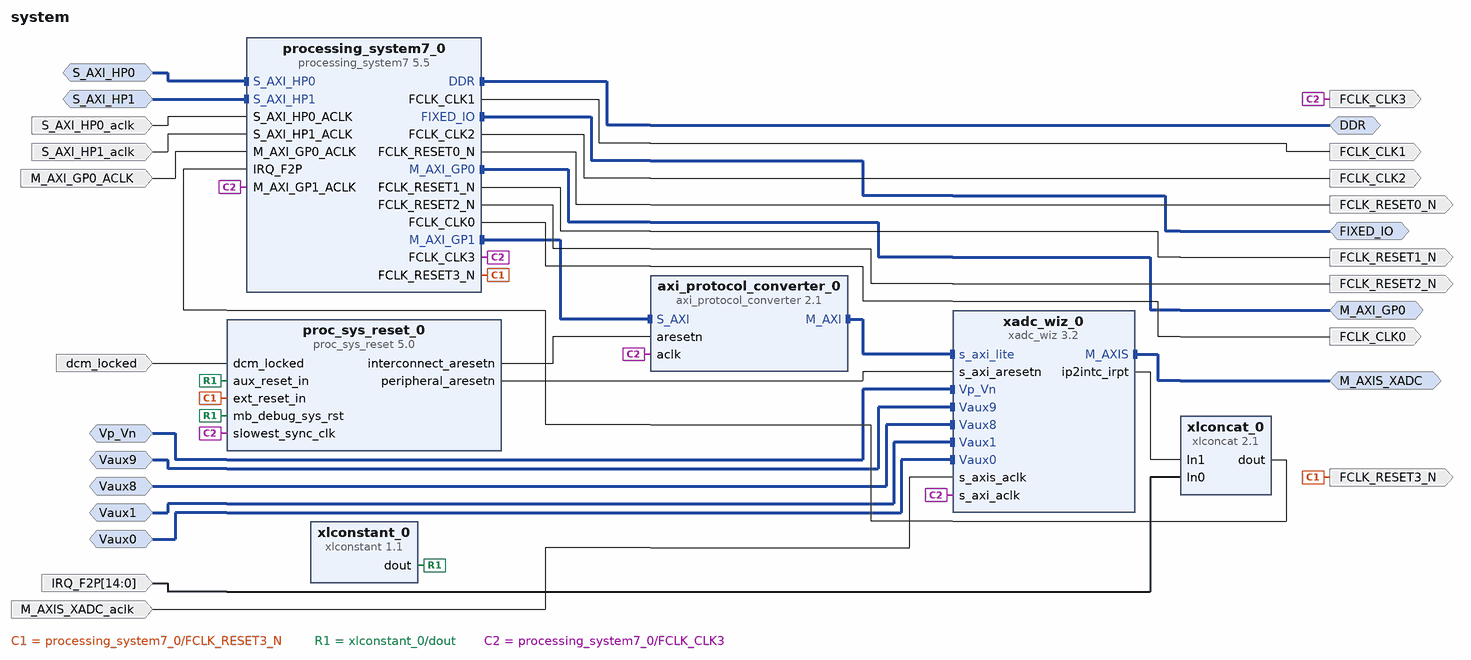
[diagram p0: block diagram of the top level]
# Vivado block design system, Vivado 2015.3
create_bd_design system

create_bd_intf_port -mode Master -vlnv xilinx.com:interface:ddrx_rtl:1.0 DDR
create_bd_intf_port -mode Master -vlnv xilinx.com:display_processing_system7:fixedio_rtl:1.0 FIXED_IO
create_bd_intf_port -mode Master -vlnv xilinx.com:interface:aximm_rtl:1.0 M_AXI_GP0
set_property -dict [list \
  CONFIG.DATA_WIDTH 32 \
  CONFIG.PROTOCOL AXI3 \
  CONFIG.FREQ_HZ 125000000 \
  CONFIG.ADDR_WIDTH 32 \
  CONFIG.NUM_READ_OUTSTANDING 1 \
  CONFIG.NUM_WRITE_OUTSTANDING 1 \
] [get_bd_intf_ports M_AXI_GP0]
create_bd_intf_port -mode Slave -vlnv xilinx.com:interface:aximm_rtl:1.0 S_AXI_HP0
set_property -dict [list \
  CONFIG.DATA_WIDTH 64 \
  CONFIG.PROTOCOL AXI3 \
  CONFIG.FREQ_HZ 125000000 \
  CONFIG.ID_WIDTH 0 \
  CONFIG.ADDR_WIDTH 32 \
  CONFIG.AWUSER_WIDTH 0 \
  CONFIG.ARUSER_WIDTH 0 \
  CONFIG.WUSER_WIDTH 0 \
  CONFIG.RUSER_WIDTH 0 \
  CONFIG.BUSER_WIDTH 0 \
  CONFIG.READ_WRITE_MODE READ_WRITE \
  CONFIG.HAS_BURST 1 \
  CONFIG.HAS_LOCK 1 \
  CONFIG.HAS_PROT 1 \
  CONFIG.HAS_CACHE 1 \
  CONFIG.HAS_QOS 1 \
  CONFIG.HAS_REGION 1 \
  CONFIG.HAS_WSTRB 1 \
  CONFIG.HAS_BRESP 1 \
  CONFIG.HAS_RRESP 1 \
  CONFIG.SUPPORTS_NARROW_BURST 1 \
  CONFIG.NUM_READ_OUTSTANDING 1 \
  CONFIG.NUM_WRITE_OUTSTANDING 1 \
  CONFIG.MAX_BURST_LENGTH 16 \
] [get_bd_intf_ports S_AXI_HP0]
create_bd_intf_port -mode Slave -vlnv xilinx.com:interface:aximm_rtl:1.0 S_AXI_HP1
set_property -dict [list \
  CONFIG.DATA_WIDTH 64 \
  CONFIG.PROTOCOL AXI3 \
  CONFIG.FREQ_HZ 125000000 \
  CONFIG.ID_WIDTH 0 \
  CONFIG.ADDR_WIDTH 32 \
  CONFIG.AWUSER_WIDTH 0 \
  CONFIG.ARUSER_WIDTH 0 \
  CONFIG.WUSER_WIDTH 0 \
  CONFIG.RUSER_WIDTH 0 \
  CONFIG.BUSER_WIDTH 0 \
  CONFIG.READ_WRITE_MODE READ_WRITE \
  CONFIG.HAS_BURST 1 \
  CONFIG.HAS_LOCK 1 \
  CONFIG.HAS_PROT 1 \
  CONFIG.HAS_CACHE 1 \
  CONFIG.HAS_QOS 1 \
  CONFIG.HAS_REGION 1 \
  CONFIG.HAS_WSTRB 1 \
  CONFIG.HAS_BRESP 1 \
  CONFIG.HAS_RRESP 1 \
  CONFIG.SUPPORTS_NARROW_BURST 1 \
  CONFIG.NUM_READ_OUTSTANDING 1 \
  CONFIG.NUM_WRITE_OUTSTANDING 1 \
  CONFIG.MAX_BURST_LENGTH 16 \
] [get_bd_intf_ports S_AXI_HP1]
create_bd_intf_port -mode Slave -vlnv xilinx.com:interface:diff_analog_io_rtl:1.0 Vp_Vn
create_bd_intf_port -mode Slave -vlnv xilinx.com:interface:diff_analog_io_rtl:1.0 Vaux9
create_bd_intf_port -mode Slave -vlnv xilinx.com:interface:diff_analog_io_rtl:1.0 Vaux8
create_bd_intf_port -mode Slave -vlnv xilinx.com:interface:diff_analog_io_rtl:1.0 Vaux1
create_bd_intf_port -mode Slave -vlnv xilinx.com:interface:diff_analog_io_rtl:1.0 Vaux0
create_bd_intf_port -mode Master -vlnv xilinx.com:interface:axis_rtl:1.0 M_AXIS_XADC
set_property -dict {CONFIG.FREQ_HZ 200000000} [get_bd_intf_ports M_AXIS_XADC]
create_bd_port -dir O -type clk FCLK_CLK1
create_bd_port -dir O -type clk FCLK_CLK2
create_bd_port -dir O -type rst FCLK_RESET0_N
create_bd_port -dir O -type rst FCLK_RESET1_N
create_bd_port -dir O -type rst FCLK_RESET2_N
create_bd_port -dir O -type rst FCLK_RESET3_N
create_bd_port -dir I -type clk S_AXI_HP0_aclk
set_property -dict {CONFIG.FREQ_HZ 125000000} [get_bd_ports S_AXI_HP0_aclk]
create_bd_port -dir I -type clk S_AXI_HP1_aclk
set_property -dict {CONFIG.FREQ_HZ 125000000} [get_bd_ports S_AXI_HP1_aclk]
create_bd_port -dir I -type clk M_AXI_GP0_ACLK
set_property -dict {CONFIG.FREQ_HZ 125000000 CONFIG.ASSOCIATED_BUSIF M_AXI_GP0} [get_bd_ports M_AXI_GP0_ACLK]
create_bd_port -dir O -type clk FCLK_CLK0
create_bd_port -dir I -from 14 -to 0 -type intr IRQ_F2P
set_property -dict {CONFIG.PortWidth 15} [get_bd_ports IRQ_F2P]
create_bd_port -dir O -type clk FCLK_CLK3
create_bd_port -dir I dcm_locked
create_bd_port -dir I -type clk M_AXIS_XADC_aclk
set_property -dict [list \
  CONFIG.FREQ_HZ 125000000 \
  CONFIG.CLK_DOMAIN system_processing_system7_0_0_FCLK_CLK3 \
] [get_bd_ports M_AXIS_XADC_aclk]

create_bd_cell -type ip -vlnv xilinx.com:ip:axi_protocol_converter:2.1 axi_protocol_converter_0
create_bd_cell -type ip -vlnv xilinx.com:ip:proc_sys_reset:5.0 proc_sys_reset_0
set_property -dict {CONFIG.C_AUX_RESET_HIGH 1 CONFIG.C_EXT_RST_WIDTH 1} [get_bd_cells proc_sys_reset_0]
create_bd_cell -type ip -vlnv xilinx.com:ip:processing_system7:5.5 processing_system7_0
set_property -dict [list \
  CONFIG.PCW_QSPI_PERIPHERAL_FREQMHZ 125 \
  CONFIG.PCW_FPGA0_PERIPHERAL_FREQMHZ 125 \
  CONFIG.PCW_FPGA1_PERIPHERAL_FREQMHZ 250 \
  CONFIG.PCW_FPGA3_PERIPHERAL_FREQMHZ 200 \
  CONFIG.PCW_USE_M_AXI_GP1 1 \
  CONFIG.PCW_USE_S_AXI_HP0 1 \
  CONFIG.PCW_USE_S_AXI_HP1 1 \
  CONFIG.PCW_USE_FABRIC_INTERRUPT 1 \
  CONFIG.PCW_EN_CLK1_PORT 1 \
  CONFIG.PCW_EN_CLK2_PORT 1 \
  CONFIG.PCW_EN_CLK3_PORT 1 \
  CONFIG.PCW_EN_RST1_PORT 1 \
  CONFIG.PCW_EN_RST2_PORT 1 \
  CONFIG.PCW_EN_RST3_PORT 1 \
  CONFIG.PCW_IRQ_F2P_INTR 1 \
  CONFIG.PCW_PRESET_BANK1_VOLTAGE {LVCMOS 2.5V} \
  CONFIG.PCW_UIPARAM_DDR_BUS_WIDTH {16 Bit} \
  CONFIG.PCW_UIPARAM_DDR_PARTNO {MT41J256M16 RE-125} \
  CONFIG.PCW_QSPI_PERIPHERAL_ENABLE 1 \
  CONFIG.PCW_QSPI_GRP_SINGLE_SS_ENABLE 1 \
  CONFIG.PCW_ENET0_PERIPHERAL_ENABLE 1 \
  CONFIG.PCW_ENET0_ENET0_IO {MIO 16 .. 27} \
  CONFIG.PCW_ENET0_GRP_MDIO_ENABLE 1 \
  CONFIG.PCW_SD0_PERIPHERAL_ENABLE 1 \
  CONFIG.PCW_SD0_GRP_CD_ENABLE 1 \
  CONFIG.PCW_SD0_GRP_CD_IO {MIO 46} \
  CONFIG.PCW_SD0_GRP_WP_ENABLE 1 \
  CONFIG.PCW_SD0_GRP_WP_IO {MIO 47} \
  CONFIG.PCW_UART0_PERIPHERAL_ENABLE 1 \
  CONFIG.PCW_UART0_UART0_IO {MIO 14 .. 15} \
  CONFIG.PCW_UART1_PERIPHERAL_ENABLE 1 \
  CONFIG.PCW_UART1_UART1_IO {MIO 8 .. 9} \
  CONFIG.PCW_SPI1_PERIPHERAL_ENABLE 1 \
  CONFIG.PCW_SPI1_SPI1_IO {MIO 10 .. 15} \
  CONFIG.PCW_TTC0_PERIPHERAL_ENABLE 1 \
  CONFIG.PCW_USB0_PERIPHERAL_ENABLE 1 \
  CONFIG.PCW_USB0_RESET_ENABLE 1 \
  CONFIG.PCW_USB0_RESET_IO {MIO 48} \
  CONFIG.PCW_I2C0_PERIPHERAL_ENABLE 1 \
  CONFIG.PCW_I2C0_I2C0_IO {MIO 50 .. 51} \
  CONFIG.PCW_GPIO_MIO_GPIO_ENABLE 1 \
  CONFIG.PCW_QSPI_PERIPHERAL_CLKSRC {ARM PLL} \
  CONFIG.PCW_ENET0_PERIPHERAL_CLKSRC {ARM PLL} \
  CONFIG.PCW_UIPARAM_GENERATE_SUMMARY NONE \
] [get_bd_cells processing_system7_0]
# 55 more settings of processing_system7_0 are not shown: defaults, MIO pin electricals, DDR timing, and values the tool derives
create_bd_cell -type ip -vlnv xilinx.com:ip:xadc_wiz:3.2 xadc_wiz_0
set_property -dict [list \
  CONFIG.WAVEFORM_TYPE SIN \
  CONFIG.XADC_STARUP_SELECTION simultaneous_sampling \
  CONFIG.DCLK_FREQUENCY 125 \
  CONFIG.ADC_CONVERSION_RATE 768 \
  CONFIG.SEQUENCER_MODE Off \
  CONFIG.SINGLE_CHANNEL_SELECTION TEMPERATURE \
  CONFIG.CHANNEL_AVERAGING 16 \
  CONFIG.ENABLE_EXTERNAL_MUX false \
  CONFIG.EXTERNAL_MUX_CHANNEL VP_VN \
  CONFIG.CHANNEL_ENABLE_VP_VN true \
  CONFIG.CHANNEL_ENABLE_VAUXP0_VAUXN0 true \
  CONFIG.CHANNEL_ENABLE_VAUXP1_VAUXN1 true \
  CONFIG.CHANNEL_ENABLE_VAUXP8_VAUXN8 true \
  CONFIG.CHANNEL_ENABLE_VAUXP9_VAUXN9 true \
  CONFIG.AVERAGE_ENABLE_VP_VN false \
  CONFIG.AVERAGE_ENABLE_VAUXP0_VAUXN0 true \
  CONFIG.AVERAGE_ENABLE_VAUXP1_VAUXN1 true \
  CONFIG.AVERAGE_ENABLE_VAUXP8_VAUXN8 true \
  CONFIG.AVERAGE_ENABLE_VAUXP9_VAUXN9 true \
  CONFIG.BIPOLAR_VP_VN false \
  CONFIG.BIPOLAR_VAUXP0_VAUXN0 true \
  CONFIG.BIPOLAR_VAUXP1_VAUXN1 true \
  CONFIG.BIPOLAR_VAUXP8_VAUXN8 true \
  CONFIG.BIPOLAR_VAUXP9_VAUXN9 true \
  CONFIG.ENABLE_AXI4STREAM true \
  CONFIG.FIFO_DEPTH 8 \
] [get_bd_cells xadc_wiz_0]
create_bd_cell -type ip -vlnv xilinx.com:ip:xlconcat:2.1 xlconcat_0
set_property -dict {CONFIG.NUM_PORTS 2 CONFIG.IN0_WIDTH 15 CONFIG.IN1_WIDTH 1} [get_bd_cells xlconcat_0]
create_bd_cell -type ip -vlnv xilinx.com:ip:xlconstant:1.1 xlconstant_0

# ---- connections ----

connect_bd_intf_net [get_bd_intf_pins axi_protocol_converter_0/M_AXI] [get_bd_intf_pins xadc_wiz_0/s_axi_lite]
connect_bd_intf_net [get_bd_intf_pins processing_system7_0/M_AXI_GP1] [get_bd_intf_pins axi_protocol_converter_0/S_AXI]
connect_bd_intf_net [get_bd_intf_ports DDR] [get_bd_intf_pins processing_system7_0/DDR]
connect_bd_intf_net [get_bd_intf_ports FIXED_IO] [get_bd_intf_pins processing_system7_0/FIXED_IO]
connect_bd_intf_net [get_bd_intf_ports M_AXI_GP0] [get_bd_intf_pins processing_system7_0/M_AXI_GP0]
connect_bd_intf_net -intf_net s_axi_hp0_1 [get_bd_intf_ports S_AXI_HP0] [get_bd_intf_pins processing_system7_0/S_AXI_HP0]
connect_bd_intf_net -intf_net s_axi_hp1_1 [get_bd_intf_ports S_AXI_HP1] [get_bd_intf_pins processing_system7_0/S_AXI_HP1]
connect_bd_intf_net [get_bd_intf_ports Vp_Vn] [get_bd_intf_pins xadc_wiz_0/Vp_Vn]
connect_bd_intf_net -intf_net Vaux9_1 [get_bd_intf_ports Vaux9] [get_bd_intf_pins xadc_wiz_0/Vaux9]
connect_bd_intf_net -intf_net Vaux8_1 [get_bd_intf_ports Vaux8] [get_bd_intf_pins xadc_wiz_0/Vaux8]
connect_bd_intf_net -intf_net Vaux1_1 [get_bd_intf_ports Vaux1] [get_bd_intf_pins xadc_wiz_0/Vaux1]
connect_bd_intf_net -intf_net Vaux0_1 [get_bd_intf_ports Vaux0] [get_bd_intf_pins xadc_wiz_0/Vaux0]
connect_bd_intf_net [get_bd_intf_ports M_AXIS_XADC] [get_bd_intf_pins xadc_wiz_0/M_AXIS]
connect_bd_net [get_bd_pins processing_system7_0/FCLK_CLK1] [get_bd_ports FCLK_CLK1]
connect_bd_net [get_bd_pins processing_system7_0/FCLK_CLK2] [get_bd_ports FCLK_CLK2]
connect_bd_net [get_bd_pins processing_system7_0/FCLK_RESET0_N] [get_bd_ports FCLK_RESET0_N]
connect_bd_net [get_bd_pins processing_system7_0/FCLK_RESET1_N] [get_bd_ports FCLK_RESET1_N]
connect_bd_net [get_bd_pins processing_system7_0/FCLK_RESET2_N] [get_bd_ports FCLK_RESET2_N]
connect_bd_net [get_bd_pins processing_system7_0/FCLK_RESET3_N] [get_bd_ports FCLK_RESET3_N] [get_bd_pins proc_sys_reset_0/ext_reset_in]
connect_bd_net [get_bd_ports S_AXI_HP0_aclk] [get_bd_pins processing_system7_0/S_AXI_HP0_ACLK]
connect_bd_net [get_bd_ports S_AXI_HP1_aclk] [get_bd_pins processing_system7_0/S_AXI_HP1_ACLK]
connect_bd_net [get_bd_ports M_AXI_GP0_ACLK] [get_bd_pins processing_system7_0/M_AXI_GP0_ACLK]
connect_bd_net [get_bd_pins processing_system7_0/FCLK_CLK0] [get_bd_ports FCLK_CLK0]
connect_bd_net [get_bd_pins proc_sys_reset_0/interconnect_aresetn] [get_bd_pins axi_protocol_converter_0/aresetn]
connect_bd_net [get_bd_pins proc_sys_reset_0/peripheral_aresetn] [get_bd_pins xadc_wiz_0/s_axi_aresetn]
connect_bd_net -net xlconstant_dout [get_bd_pins xlconstant_0/dout] \
  [get_bd_pins proc_sys_reset_0/aux_reset_in] [get_bd_pins proc_sys_reset_0/mb_debug_sys_rst]
connect_bd_net [get_bd_pins xlconcat_0/dout] [get_bd_pins processing_system7_0/IRQ_F2P]
connect_bd_net [get_bd_ports IRQ_F2P] [get_bd_pins xlconcat_0/In0]
connect_bd_net [get_bd_pins xadc_wiz_0/ip2intc_irpt] [get_bd_pins xlconcat_0/In1]
connect_bd_net [get_bd_pins processing_system7_0/FCLK_CLK3] \
  [get_bd_ports FCLK_CLK3] [get_bd_pins axi_protocol_converter_0/aclk] [get_bd_pins processing_system7_0/M_AXI_GP1_ACLK] \
  [get_bd_pins proc_sys_reset_0/slowest_sync_clk] [get_bd_pins xadc_wiz_0/s_axi_aclk]
connect_bd_net [get_bd_ports dcm_locked] [get_bd_pins proc_sys_reset_0/dcm_locked]
connect_bd_net [get_bd_ports M_AXIS_XADC_aclk] [get_bd_pins xadc_wiz_0/s_axis_aclk]

# ---- address map ----
assign_bd_address -offset 0x40000000 -range 1G -target_address_space [get_bd_addr_spaces processing_system7_0/Data] [get_bd_addr_segs M_AXI_GP0/Reg]
assign_bd_address -offset 0x83C00000 -range 64K -target_address_space [get_bd_addr_spaces processing_system7_0/Data] [get_bd_addr_segs xadc_wiz_0/s_axi_lite/Reg]
assign_bd_address -offset 0x00000000 -range 512M -target_address_space [get_bd_addr_spaces S_AXI_HP0] [get_bd_addr_segs processing_system7_0/S_AXI_HP0/HP0_DDR_LOWOCM]
assign_bd_address -offset 0x00000000 -range 512M -target_address_space [get_bd_addr_spaces S_AXI_HP1] [get_bd_addr_segs processing_system7_0/S_AXI_HP1/HP1_DDR_LOWOCM]

validate_bd_design
save_bd_design
